# EAGLE design Rev7 (EAGLE 6.5.0)
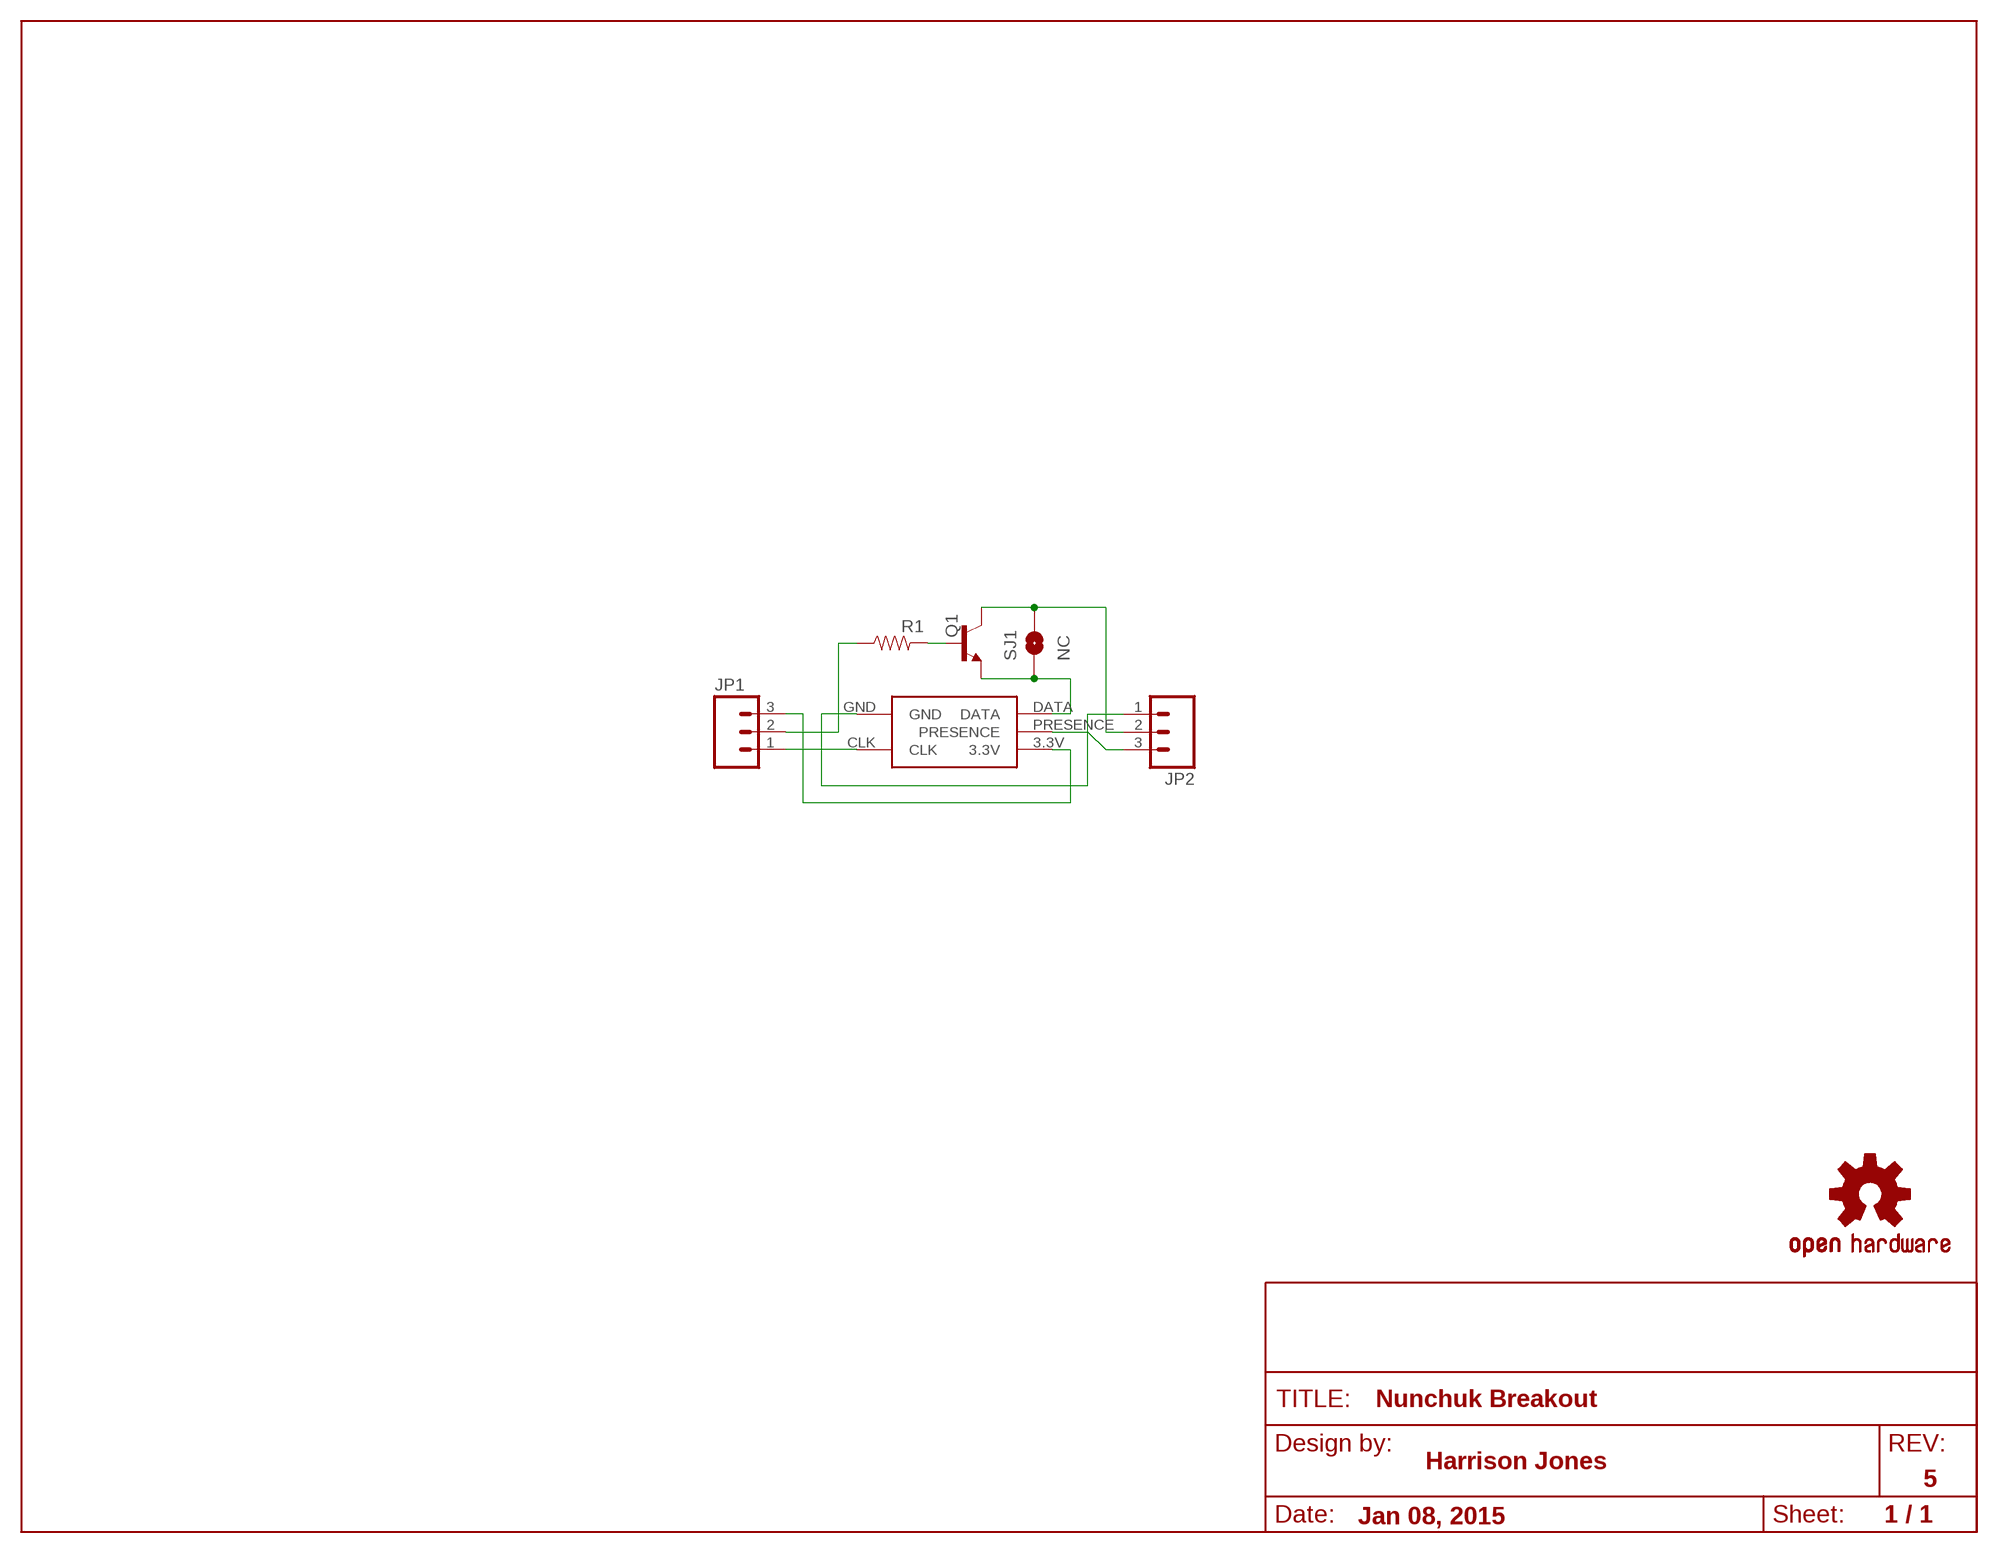
[diagram p0: schematic, sheet 1]

## Parts
JP1  M03PTH  [1X03]
JP2  M03PTH  [1X03]
LOGO1  OSHW-LOGOS  [OSHW-LOGO-S]
Q1  TRANSISTOR_NPNSOT23  [SOT23]
R1  RESISTOR0603  [0603-RES]
SJ1  NC  SOLDERJUMPERTRACE  [SJ_2S-TRACE]
U$1  NUNCHUCKLOCL  [NUNCHUCK-LOCK]
U$2  DOC_FIELD  [DOC_FIELD]

## Nets
3.3V: JP1.3 U$1.3.3V
EN: JP1.2 R1.1
GND: JP2.1 U$1.GND
N$1: Q1.1(B) R1.2
N$2: JP2.3 U$1.PRESENCE
N$6: JP2.2 Q1.3(C) SJ1.2
SCL: JP1.1 U$1.CLK
SDA: Q1.2(E) SJ1.1 U$1.DATA

## Notes on the sheet
- Nunchuk Breakout
- Harrison Jones
- 5
- Jan 08, 2015 | 1 / 1

## Library data of the parts
JP1 JP2 = SparkFun-Connectors:M03: Header 3 Standard 3-pin 0.1" header. Use with straight break away headers (SKU : PRT-00116), right angle break away headers (PRT-00553), swiss pins (PRT-00743), machine pins (PRT-00117), and female headers (PRT-00115). Molex polarized connector foot print use with SKU : PRT-08232 with associated crimp pins and housings.
LOGO1 = SparkFun-Aesthetics:OSHW-LOGO: Open Source Hardware Logo This logo indicates the piece of hardware it is found on incorporates a OSHW license and/or adheres to the definition of open source hardware found here: http://freedomdefined.org/OSHW
Q1 = SparkFun-DiscreteSemi:TRANSISTOR_NPN: Generic NPN BJT MMBT2222A - TRANS-08049 (SOT-23, 1A 40V) MPSA42 - TRANS-09116 (SOT-23, 500mA 300V) MMBT5088LT1G - TRANS-11160 (SOT-23, 50 mA 30V)
R1 = SparkFun-Resistors:RESISTOR: Resistor Basic schematic elements and footprints for 0603, 1206, and PTH resistors.
SJ1 = SparkFun-Passives:SOLDERJUMPER: Solder Jumper Standard SMD solder jumper. Used to automate production. Two varients : Normally Open and Normally Closed are the same, but have different paste layers. NC will have a large amount of paste and should jumper during reflow.
U$1 = HHJ:NUNCHUCK
U$2 = HHJ:DOC_FIELD

## Board
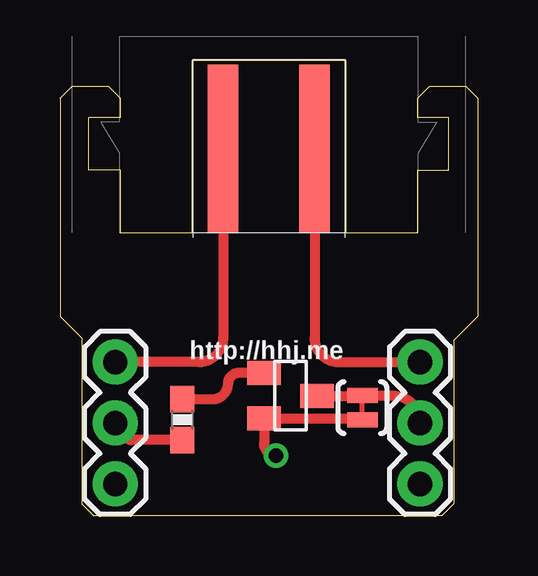
[diagram p1: board, top side]
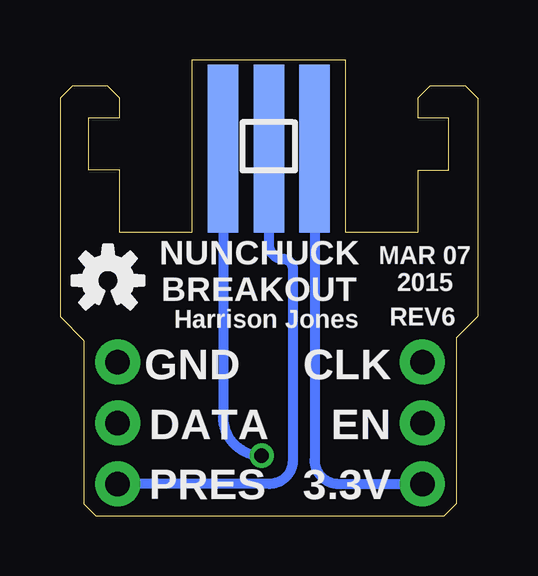
[diagram p2: board, bottom side, seen from below]

Size 17.4 x 19 mm. Coordinates in mm from the lower left corner, seen from the top.
Outline: 0,17.4 0,8.3 0.9,7.4 0.9,0.5 1.4,0 15.9,0 16.4,0.5 16.4,7.3 17.4,8.3 17.4,17.4 16.9,17.9 15.4,17.9 14.9,17.4 14.9,16.6 16.2,16.6 16.2,14.4 14.9,14.4 14.9,11.8 11.9,11.8 11.9,19 5.5,19 5.5,11.8 2.5,11.8 2.5,14.4 1.2,14.4 1.2,16.6 2.5,16.6 2.5,17.4 2,17.9 0.5,17.9 0,17.4
Copper layers (1*16): Top 0.035mm / dielectric 1.5mm / Bottom 0.035mm
Design rules "default": minimum track width 10mil, minimum drill 0.6mm, track to track 8mil, track to pad 8mil, pad to pad 8mil, via to via 8mil, smd to smd 8mil, copper to edge 40mil, drill to drill 8mil, minimum pad ring 10mil, minimum via ring 8mil, stop-mask expansion 4mil, vias tented up to drill 0mil, thermal gap 10mil

### Footprints (pad centres in the part's own frame; a part is rotated, then mirrored left to right if it is on the bottom)
1X03 = drill 1.016 pad 1.88: 1 0,0; 2 2.54,0; 3 5.08,0
SOT23 = smd 1 x 1.4: 1 -0.95,-1.1; 2 0.95,-1.1; 3 0,1.1
0603-RES = smd 1.1 x 1: 1 -0.85,0; 2 0.85,0
SJ_2S-TRACE = smd 0.635 x 1.27: 1 -0.508,0; 2 0.508,0
NUNCHUCK-LOCK = smd 1.27 x 6.985 bottom: 3.3V -1.905,1.5; DATA 1.905,1.5; PRESENCE 0,1.5 | smd 1.27 x 6.985: CLK -1.905,1.5; GND 1.905,1.5

### Placement (x,y rotation side)
JP1  2.3,6.4 270 top
JP2  15,6.4 270 top
LOGO1  15.4,9.8 0 bottom
Q1  9.6,5 270 top
R1  5.1,4 90 top
SJ1  12.6,4.5 90 top
U$1  8.7,13.8 0 top
U$2  8.5,-1 0 top

### Tracks (layer width: path | path; a pad name or v marks a point on that pad's centre or on a via)
3.3V
  Bottom 0.406: U$1.3.3V 6.79,2.32 arc-90 5.79,1.32 JP1.3
EN
  Top 0.406: R1.1 3.01,3.15 arc-90 JP1.2
GND
  Top 0.406: U$1.GND 10.61,7.4 arc90 11.61,6.4 JP2.1
N$1
  Top 0.406: Q1.1 7.45,5.95 arc90 7,5.5 arc-90 6.35,4.85 R1.2
N$2
  Bottom 0.406: U$1.PRESENCE 8.7,11.3 arc-90 8.1,10.7 arc90 7.7,10.3 7.7,2.3 arc90 8.68,1.32 JP2.3
N$6
  Top 0.406: Q1.3 SJ1.2 arc90 SJ1.2 13.85,5.01 arc-90 JP2.2
SCL
  Top 0.406: U$1.CLK 6.79,7.4 arc-90 5.79,6.4 JP1.1
SDA  (via drill 0.6)
  Top 0.406: SJ1.1 arc90 12.54,4.05 Q1.2 8.5,3 arc90 v9,2.5
  Bottom 0.406: U$1.DATA 10.61,4.11 arc-90 v9,2.5

### Text on the board
tPlace: http://hhj.me
bPlace: MAR 07 / 2015 | NUNCHUCK / BREAKOUT | REV6 | Harrison Jones | CLK | GND | EN | DATA | 3.3V | PRES